# EAGLE design FullTouchSmartphone (EAGLE 8.0.2)
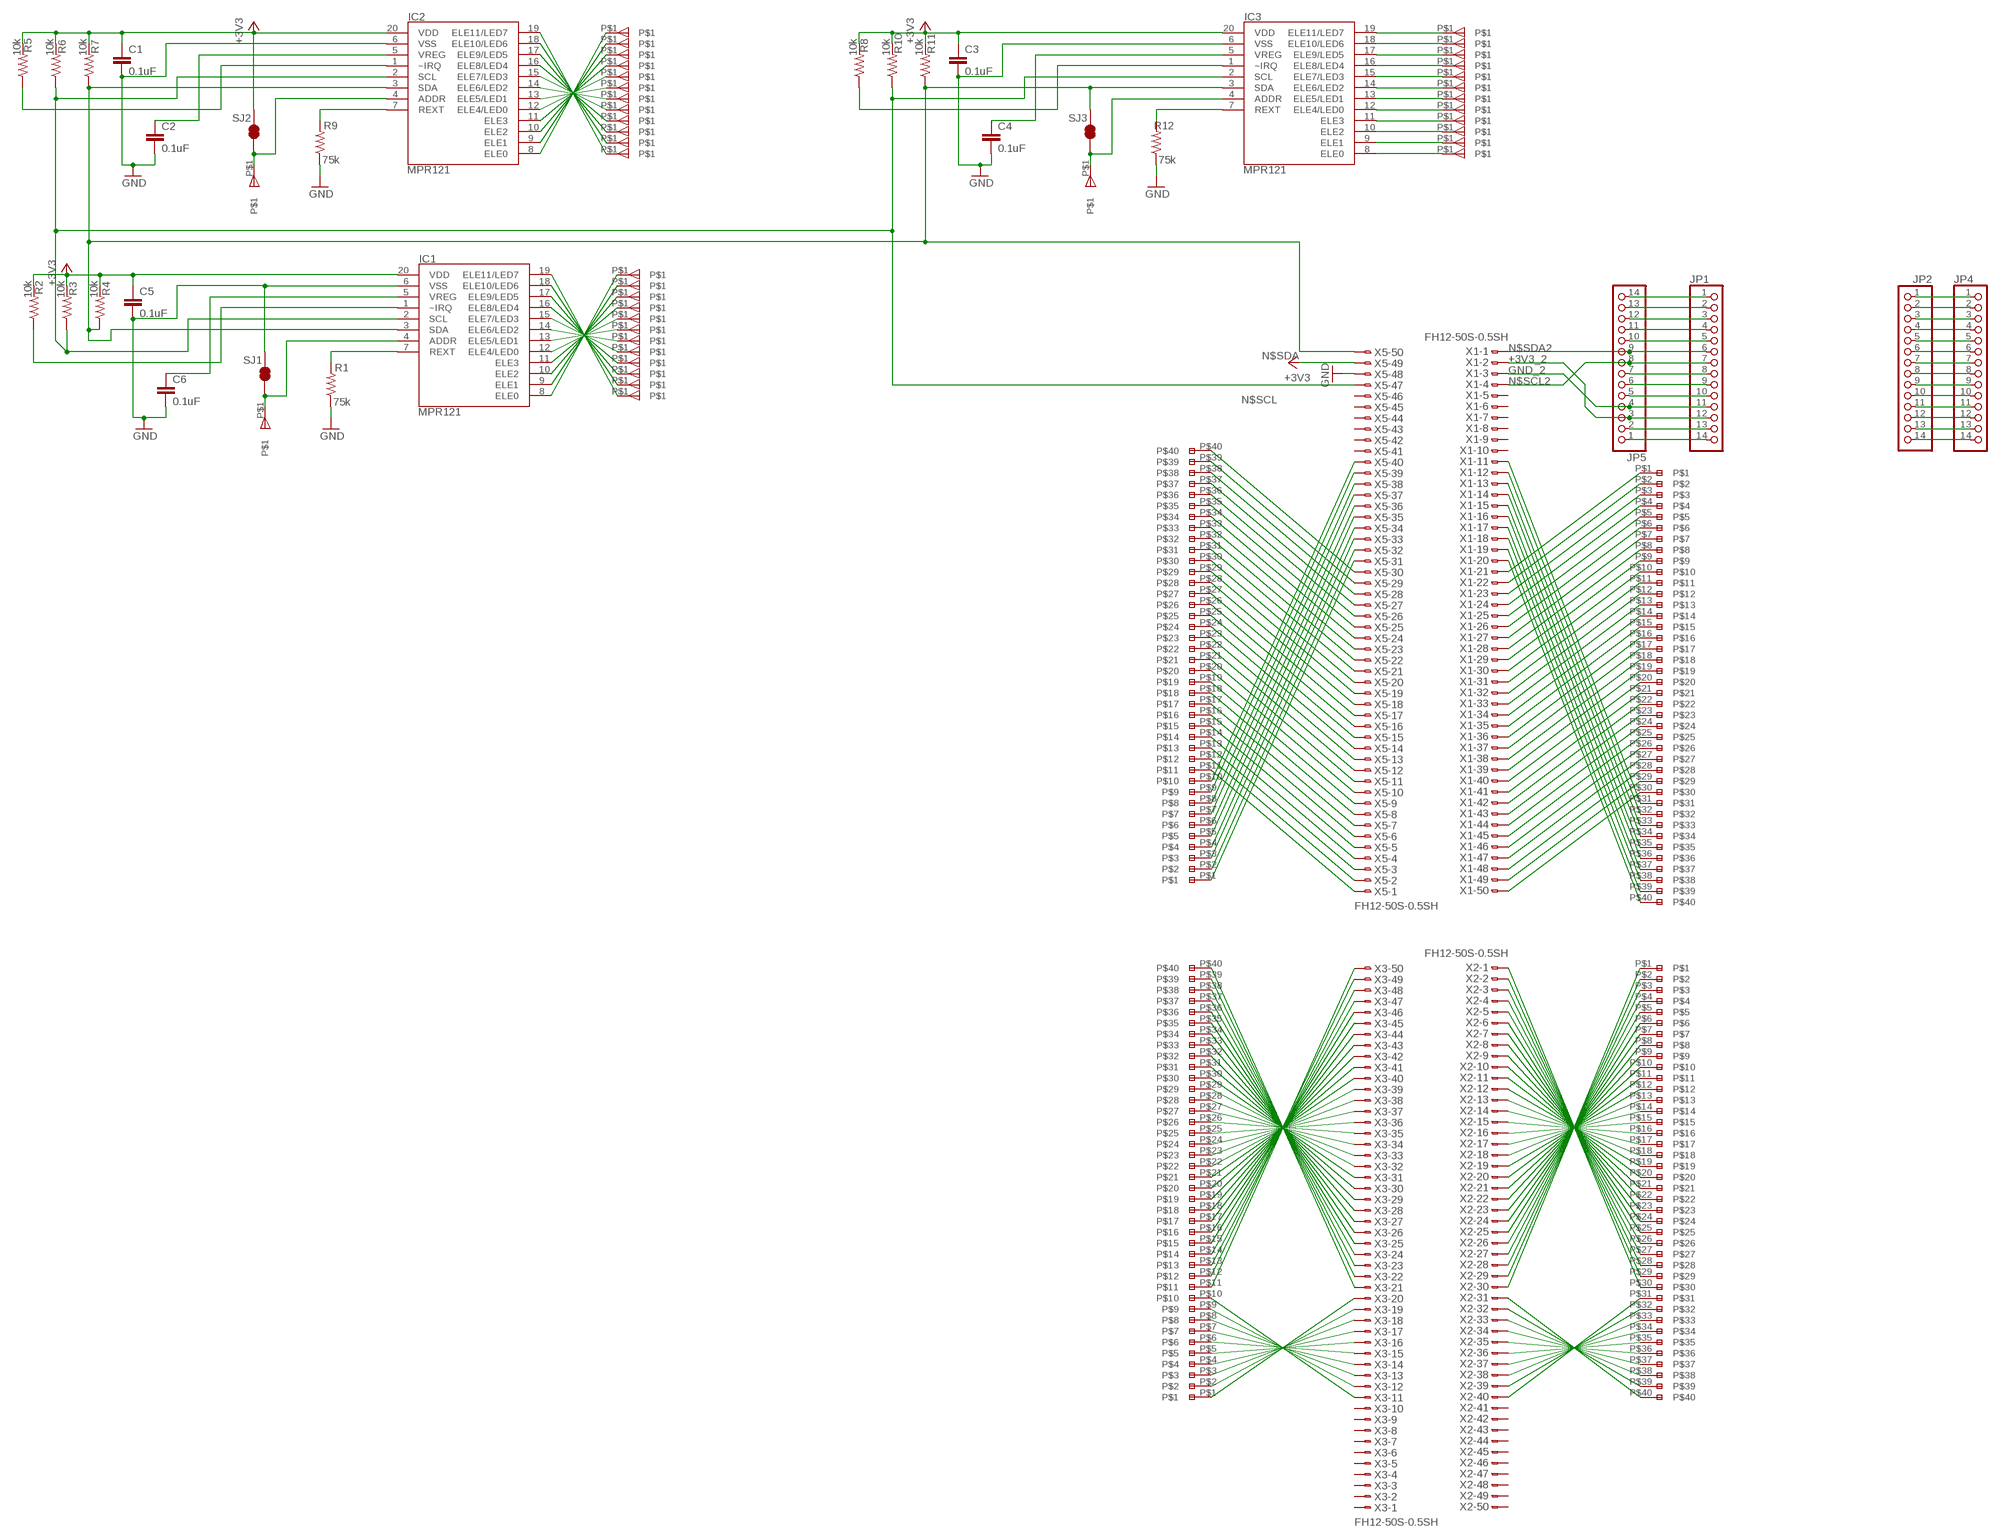
[diagram p0: schematic, sheet 1]

## Parts
C1  0.1uF  CAP0603-CAP  [0603-CAP]
C2  0.1uF  CAP0603-CAP  [0603-CAP]
C3  0.1uF  CAP0603-CAP  [0603-CAP]
C4  0.1uF  CAP0603-CAP  [0603-CAP]
C5  0.1uF  CAP0603-CAP  [0603-CAP]
C6  0.1uF  CAP0603-CAP  [0603-CAP]
IC1  MPR121  MPR121V2  [QFN-20-0.4MM-V2]
IC2  MPR121  MPR121V2  [QFN-20-0.4MM-V2]
IC3  MPR121  MPR121V2  [QFN-20-0.4MM-V2]
JP1  PINHD-1X14  [1X14]
JP2  PINHD-1X14  [1X14]
JP4  PINHD-1X14  [1X14]
JP5  PINHD-1X14  [1X14]
R1  75k  RESISTOR0603-RES  [0603-RES]
R2  10k  RESISTOR0603-RES  [0603-RES]
R3  10k  RESISTOR0603-RES  [0603-RES]
R4  10k  RESISTOR0603-RES  [0603-RES]
R5  10k  RESISTOR0603-RES  [0603-RES]
R6  10k  RESISTOR0603-RES  [0603-RES]
R7  10k  RESISTOR0603-RES  [0603-RES]
R8  10k  RESISTOR0603-RES  [0603-RES]
R9  75k  RESISTOR0603-RES  [0603-RES]
R10  10k  RESISTOR0603-RES  [0603-RES]
R11  10k  RESISTOR0603-RES  [0603-RES]
R12  75k  RESISTOR0603-RES  [0603-RES]
SJ1  SOLDERJUMPERTRACE  [SJ_2S-TRACE]
SJ2  SOLDERJUMPERTRACE  [SJ_2S-TRACE]
SJ3  SOLDERJUMPERTRACE  [SJ_2S-TRACE]
U$1  AXE640124  [AXE640124]
U$2  AXE640124  [AXE640124]
U$3  AXE540127  [AXE540127]
U$4  SINGLE_LÖT_SPOT_K  [SINGLE_LÖT_SPOT_K]
U$5  SINGLE_LÖT_SPOT_K  [SINGLE_LÖT_SPOT_K]
U$6  SINGLE_LÖT_SPOT_K  [SINGLE_LÖT_SPOT_K]
U$7  SINGLE_LÖT_SPOT_K  [SINGLE_LÖT_SPOT_K]
U$8  SINGLE_LÖT_SPOT_K  [SINGLE_LÖT_SPOT_K]
U$9  SINGLE_LÖT_SPOT_K  [SINGLE_LÖT_SPOT_K]
U$10  SINGLE_LÖT_SPOT_K  [SINGLE_LÖT_SPOT_K]
U$11  SINGLE_LÖT_SPOT_K  [SINGLE_LÖT_SPOT_K]
U$12  SINGLE_LÖT_SPOT_K  [SINGLE_LÖT_SPOT_K]
U$13  SINGLE_LÖT_SPOT_K  [SINGLE_LÖT_SPOT_K]
U$14  SINGLE_LÖT_SPOT_K  [SINGLE_LÖT_SPOT_K]
U$15  SINGLE_LÖT_SPOT_K  [SINGLE_LÖT_SPOT_K]
U$25  SINGLE_LÖT_SPOT_K  [SINGLE_LÖT_SPOT_K]
U$26  SINGLE_LÖT_SPOT_K  [SINGLE_LÖT_SPOT_K]
U$27  SINGLE_LÖT_SPOT_K  [SINGLE_LÖT_SPOT_K]
U$28  SINGLE_LÖT_SPOT_K  [SINGLE_LÖT_SPOT_K]
U$29  SINGLE_LÖT_SPOT_K  [SINGLE_LÖT_SPOT_K]
U$30  SINGLE_LÖT_SPOT_K  [SINGLE_LÖT_SPOT_K]
U$31  SINGLE_LÖT_SPOT_K  [SINGLE_LÖT_SPOT_K]
U$32  SINGLE_LÖT_SPOT_K  [SINGLE_LÖT_SPOT_K]
U$33  SINGLE_LÖT_SPOT_K  [SINGLE_LÖT_SPOT_K]
U$34  SINGLE_LÖT_SPOT_K  [SINGLE_LÖT_SPOT_K]
U$35  SINGLE_LÖT_SPOT_K  [SINGLE_LÖT_SPOT_K]
U$36  SINGLE_LÖT_SPOT_K  [SINGLE_LÖT_SPOT_K]
U$37  SINGLE_LÖT_SPOT_K  [SINGLE_LÖT_SPOT_K]
U$38  SINGLE_LÖT_SPOT_K  [SINGLE_LÖT_SPOT_K]
U$39  SINGLE_LÖT_SPOT_K  [SINGLE_LÖT_SPOT_K]
U$40  SINGLE_LÖT_SPOT_K  [SINGLE_LÖT_SPOT_K]
U$40PIN-BACK  AXE540127  [AXE540127]
U$41  SINGLE_LÖT_SPOT_K  [SINGLE_LÖT_SPOT_K]
U$42  SINGLE_LÖT_SPOT_K  [SINGLE_LÖT_SPOT_K]
U$43  SINGLE_LÖT_SPOT_K  [SINGLE_LÖT_SPOT_K]
U$44  SINGLE_LÖT_SPOT_K  [SINGLE_LÖT_SPOT_K]
U$45  SINGLE_LÖT_SPOT_K  [SINGLE_LÖT_SPOT_K]
U$46  SINGLE_LÖT_SPOT_K  [SINGLE_LÖT_SPOT_K]
U$47  SINGLE_LÖT_SPOT_K  [SINGLE_LÖT_SPOT_K]
U$48  SINGLE_LÖT_SPOT_K  [SINGLE_LÖT_SPOT_K]
U$49  SINGLE_LÖT_SPOT_K  [SINGLE_LÖT_SPOT_K]
U$50  SINGLE_LÖT_SPOT_K  [SINGLE_LÖT_SPOT_K]
U$51  SINGLE_LÖT_SPOT_K  [SINGLE_LÖT_SPOT_K]
X1  FH12-50S-0.5SH  [FH12-50S-0.5SH]
X2  FH12-50S-0.5SH  [FH12-50S-0.5SH]
X3  FH12-50S-0.5SH  [FH12-50S-0.5SH]
X5  FH12-50S-0.5SH  [FH12-50S-0.5SH]

## Nets
+3V3: C1.1 C3.1 C5.1 IC1.20(VDD) IC2.20(VDD) IC3.20(VDD) R2.2 R3.2 R4.2 R5.2 R6.2 R7.2 R8.2 R10.2 R11.2 SJ2.2 X5.49
+3V3_2: JP1.12 JP5.3 X1.2
GND: C1.2 C2.2 C3.2 C4.2 C5.2 C6.2 IC1.6(VSS) IC2.6(VSS) IC3.6(VSS) R1.1 R9.1 R12.1 SJ1.2 X5.48
GND_2: JP1.11 JP5.4 X1.3
N$1: U$40PIN-BACK.P$10 X5.40
N$2: U$40PIN-BACK.P$9 X5.39
N$3: U$40PIN-BACK.P$8 X5.38
N$4: U$40PIN-BACK.P$7 X5.37
N$5: U$40PIN-BACK.P$6 X5.36
N$6: U$40PIN-BACK.P$5 X5.35
N$7: U$40PIN-BACK.P$4 X5.34
N$8: U$40PIN-BACK.P$3 X5.33
N$9: U$40PIN-BACK.P$2 X5.32
N$10: U$40PIN-BACK.P$1 X5.31
N$11: U$40PIN-BACK.P$20 X5.10
N$12: U$40PIN-BACK.P$19 X5.9
N$13: U$40PIN-BACK.P$18 X5.8
N$14: U$40PIN-BACK.P$17 X5.7
N$15: U$40PIN-BACK.P$16 X5.6
N$16: U$40PIN-BACK.P$15 X5.5
N$17: U$40PIN-BACK.P$14 X5.4
N$18: U$40PIN-BACK.P$13 X5.3
N$19: U$40PIN-BACK.P$12 X5.2
N$20: U$40PIN-BACK.P$11 X5.1
N$21: U$40PIN-BACK.P$40 X5.30
N$22: U$40PIN-BACK.P$39 X5.29
N$23: U$40PIN-BACK.P$38 X5.28
N$24: U$40PIN-BACK.P$37 X5.27
N$25: U$40PIN-BACK.P$36 X5.26
N$26: U$40PIN-BACK.P$35 X5.25
N$27: U$40PIN-BACK.P$33 X5.23
N$28: U$40PIN-BACK.P$34 X5.24
N$29: U$40PIN-BACK.P$32 X5.22
N$30: U$40PIN-BACK.P$31 X5.21
N$31: U$40PIN-BACK.P$30 X5.20
N$32: U$40PIN-BACK.P$29 X5.19
N$33: U$40PIN-BACK.P$28 X5.18
N$34: U$40PIN-BACK.P$27 X5.17
N$35: U$40PIN-BACK.P$26 X5.16
N$36: U$40PIN-BACK.P$25 X5.15
N$37: U$40PIN-BACK.P$24 X5.14
N$38: U$40PIN-BACK.P$23 X5.13
N$39: U$40PIN-BACK.P$22 X5.12
N$40: U$40PIN-BACK.P$21 X5.11
N$41: U$2.P$31 X1.11
N$42: U$2.P$30 X1.50
N$43: U$2.P$29 X1.49
N$44: U$2.P$28 X1.48
N$45: U$2.P$27 X1.47
N$46: U$2.P$26 X1.46
N$47: U$2.P$25 X1.45
N$48: U$2.P$24 X1.44
N$49: U$2.P$23 X1.43
N$50: U$2.P$21 X1.41
N$51: U$2.P$22 X1.42
N$52: U$2.P$20 X1.40
N$53: U$2.P$19 X1.39
N$54: U$2.P$18 X1.38
N$55: U$2.P$17 X1.37
N$56: U$2.P$15 X1.35
N$57: U$2.P$16 X1.36
N$58: U$2.P$14 X1.34
N$59: U$2.P$13 X1.33
N$60: U$2.P$12 X1.32
N$61: U$2.P$11 X1.31
N$62: U$2.P$10 X1.30
N$63: U$2.P$9 X1.29
N$64: U$2.P$8 X1.28
N$65: U$2.P$7 X1.27
N$66: U$2.P$6 X1.26
N$67: U$2.P$5 X1.25
N$68: U$2.P$4 X1.24
N$69: U$2.P$3 X1.23
N$70: U$2.P$2 X1.22
N$71: U$2.P$1 X1.21
N$72: U$2.P$32 X1.12
N$73: U$2.P$33 X1.13
N$74: U$2.P$34 X1.14
N$75: U$2.P$35 X1.15
N$76: U$2.P$36 X1.16
N$77: U$2.P$37 X1.17
N$78: U$2.P$38 X1.18
N$79: U$2.P$39 X1.19
N$80: U$2.P$40 X1.20
N$81: U$3.P$20 X3.41
N$82: U$3.P$11 X3.50
N$83: U$3.P$21 X3.40
N$84: U$3.P$22 X3.39
N$85: U$3.P$23 X3.38
N$86: U$3.P$24 X3.37
N$87: U$3.P$25 X3.36
N$88: U$3.P$26 X3.35
N$89: U$3.P$27 X3.34
N$90: U$3.P$28 X3.33
N$91: U$3.P$29 X3.32
N$92: U$3.P$30 X3.31
N$93: U$3.P$31 X3.30
N$94: U$3.P$32 X3.29
N$95: U$3.P$33 X3.28
N$96: U$3.P$34 X3.27
N$97: U$3.P$35 X3.26
N$98: U$3.P$36 X3.25
N$99: U$3.P$37 X3.24
N$100: U$3.P$38 X3.23
N$101: U$3.P$39 X3.22
N$102: U$3.P$40 X3.21
N$103: U$3.P$19 X3.42
N$104: U$3.P$18 X3.43
N$105: U$3.P$17 X3.44
N$106: U$3.P$16 X3.45
N$107: U$3.P$15 X3.46
N$108: U$3.P$14 X3.47
N$109: U$3.P$13 X3.48
N$110: U$3.P$12 X3.49
N$111: U$3.P$1 X3.20
N$112: U$3.P$2 X3.19
N$113: U$3.P$3 X3.18
N$114: U$3.P$4 X3.17
N$115: U$3.P$5 X3.16
N$116: U$3.P$6 X3.15
N$117: U$3.P$7 X3.14
N$118: U$3.P$8 X3.13
N$119: U$3.P$9 X3.12
N$120: U$3.P$10 X3.11
N$121: U$1.P$31 X2.40
N$122: U$1.P$32 X2.39
N$123: U$1.P$33 X2.38
N$124: U$1.P$34 X2.37
N$125: U$1.P$35 X2.36
N$126: U$1.P$36 X2.35
N$127: U$1.P$37 X2.34
N$128: U$1.P$38 X2.33
N$129: U$1.P$39 X2.32
N$130: U$1.P$40 X2.31
N$131: U$1.P$30 X2.1
N$132: U$1.P$29 X2.2
N$133: U$1.P$28 X2.3
N$134: U$1.P$27 X2.4
N$135: U$1.P$26 X2.5
N$136: U$1.P$25 X2.6
N$137: U$1.P$24 X2.7
N$138: U$1.P$23 X2.8
N$139: U$1.P$22 X2.9
N$140: U$1.P$21 X2.10
N$141: U$1.P$20 X2.11
N$142: U$1.P$19 X2.12
N$143: U$1.P$18 X2.13
N$144: U$1.P$17 X2.14
N$145: U$1.P$16 X2.15
N$146: U$1.P$15 X2.16
N$147: U$1.P$14 X2.17
N$148: U$1.P$13 X2.18
N$149: U$1.P$12 X2.19
N$150: U$1.P$11 X2.20
N$151: U$1.P$10 X2.21
N$152: U$1.P$9 X2.22
N$153: U$1.P$8 X2.23
N$154: U$1.P$7 X2.24
N$155: U$1.P$6 X2.25
N$156: U$1.P$5 X2.26
N$157: U$1.P$4 X2.27
N$158: U$1.P$3 X2.28
N$159: U$1.P$2 X2.29
N$160: U$1.P$1 X2.30
N$165: IC1.19(ELE11/LED7) U$15.P$1
N$166: IC1.18(ELE10/LED6) U$14.P$1
N$167: IC1.17(ELE9/LED5) U$13.P$1
N$168: IC1.16(ELE8/LED4) U$12.P$1
N$169: IC1.15(ELE7/LED3) U$11.P$1
N$170: IC1.14(ELE6/LED2) U$10.P$1
N$171: IC1.13(ELE5/LED1) U$9.P$1
N$172: IC1.12(ELE4/LED0) U$8.P$1
N$173: IC1.11(ELE3) U$7.P$1
N$174: IC1.10(ELE2) U$6.P$1
N$175: IC1.9(ELE1) U$5.P$1
N$176: IC1.8(ELE0) U$4.P$1
N$177: IC3.19(ELE11/LED7) U$40.P$1
N$178: IC3.18(ELE10/LED6) U$41.P$1
N$179: IC3.17(ELE9/LED5) U$42.P$1
N$180: IC3.16(ELE8/LED4) U$43.P$1
N$181: IC3.15(ELE7/LED3) U$44.P$1
N$182: IC3.14(ELE6/LED2) U$45.P$1
N$183: IC3.13(ELE5/LED1) U$46.P$1
N$184: IC3.12(ELE4/LED0) U$47.P$1
N$185: IC3.10(ELE2) U$49.P$1
N$186: IC3.11(ELE3) U$48.P$1
N$187: IC3.9(ELE1) U$50.P$1
N$188: IC3.8(ELE0) U$51.P$1
N$189: JP2.1 JP4.1
N$190: JP2.2 JP4.2
N$192: C6.1 IC1.5(VREG)
N$193: C2.1 IC2.5(VREG)
N$194: IC1.7(REXT) R1.2
N$195: IC2.8(ELE0) U$36.P$1
N$196: IC2.9(ELE1) U$35.P$1
N$197: C4.1 IC3.5(VREG)
N$198: IC2.10(ELE2) U$34.P$1
N$199: IC2.11(ELE3) U$33.P$1
N$200: IC2.12(ELE4/LED0) U$32.P$1
N$201: IC2.13(ELE5/LED1) U$31.P$1
N$202: IC2.14(ELE6/LED2) U$30.P$1
N$203: IC2.15(ELE7/LED3) U$29.P$1
N$204: IC2.16(ELE8/LED4) U$28.P$1
N$205: IC2.17(ELE9/LED5) U$27.P$1
N$206: IC2.18(ELE10/LED6) U$26.P$1
N$207: IC2.19(ELE11/LED7) U$25.P$1
N$228: IC1.4(ADDR) SJ1.1 U$37.P$1
N$230: IC2.7(REXT) R9.2
N$231: IC3.7(REXT) R12.2
N$243: IC2.4(ADDR) SJ2.1 U$38.P$1
N$244: IC3.4(ADDR) SJ3.1 U$39.P$1
N$245: JP2.3 JP4.3
N$246: JP2.4 JP4.4
N$247: JP2.5 JP4.5
N$248: JP2.6 JP4.6
N$249: JP2.7 JP4.7
N$250: JP2.8 JP4.8
N$251: JP2.9 JP4.9
N$252: JP2.10 JP4.10
N$253: JP2.11 JP4.11
N$254: JP2.12 JP4.12
N$255: JP2.13 JP4.13
N$256: JP2.14 JP4.14
N$257: JP1.1 JP5.14
N$258: JP1.2 JP5.13
N$259: JP1.3 JP5.12
N$260: JP1.4 JP5.11
N$261: JP1.5 JP5.10
N$262: JP1.8 JP5.7
N$263: JP1.9 JP5.6
N$264: JP1.10 JP5.5
N$265: JP1.13 JP5.2
N$266: JP1.14 JP5.1
N$IRQ1: IC1.1(~IRQ) R2.1
N$IRQ2: IC2.1(~IRQ) R5.1
N$IRQ3: IC3.1(~IRQ) R8.1
N$SCL: IC1.2(SCL) IC2.2(SCL) IC3.2(SCL) R3.1 R6.1 R10.1 X5.47
N$SCL2: JP1.7 JP5.8 X1.4
N$SDA: IC1.3(SDA) IC2.3(SDA) IC3.3(SDA) R4.1 R7.1 R11.1 SJ3.2 X5.50
N$SDA2: JP1.6 JP5.9 X1.1
Unconnected: X1.5 X1.6 X1.7 X1.8 X1.9 X1.10 X2.41 X2.42 X2.43 X2.44 X2.45 X2.46 X2.47 X2.48 X2.49 X2.50 X3.1 X3.2 X3.3 X3.4 X3.5 X3.6 X3.7 X3.8 X3.9 X3.10 X5.41 X5.42 X5.43 X5.44 X5.45 X5.46

## Library data of the parts
C1-C6 = SparkFun:CAP: Capacitor Standard 0603 ceramic capacitor, and 0.1" leaded capacitor.
IC1-IC3 = Testing:MPR121: MPR121 Capacitive Touch Sensor Controller. Variant "V2" was created using an image import of the bottom of the IC. It matches metal to metal.
JP1 JP2 JP4 JP5 = pinhead:PINHD-1X14: PIN HEADER
R1-R12 = SparkFun:RESISTOR: Resistor Basic schematic elements and footprints for 0603, 1206, and PTH 1/10th watt (small) resistors.
SJ1-SJ3 = SparkFun:SOLDERJUMPER: Solder Jumper Standard SMD solder jumper. Used to automate production. Two varients : Normally Open and Normally Closed are the same, but have different paste layers. NC will have a large amount of paste and should jumper during reflow.
U$1 U$2 = axexxxxxx:AXE640124
U$3 U$40PIN-BACK = axexxxxxx:AXE540127
U$4-U$15 U$25-U$51 = single_löt_spot:SINGLE_LÖT_SPOT_K
X1-X3 X5 = con-hirose:FH12-50S-0.5S: 0.5mm Pitch Connectors For FPC/FFC Source: Data sheet <http://www.hirose.co.jp/cataloge_hp/e58605370.pdf>; MPN: FH12-50S-0.5SH(55); OC_FARNELL: 1324557; OC_NEWARK: 34M6181

## Board
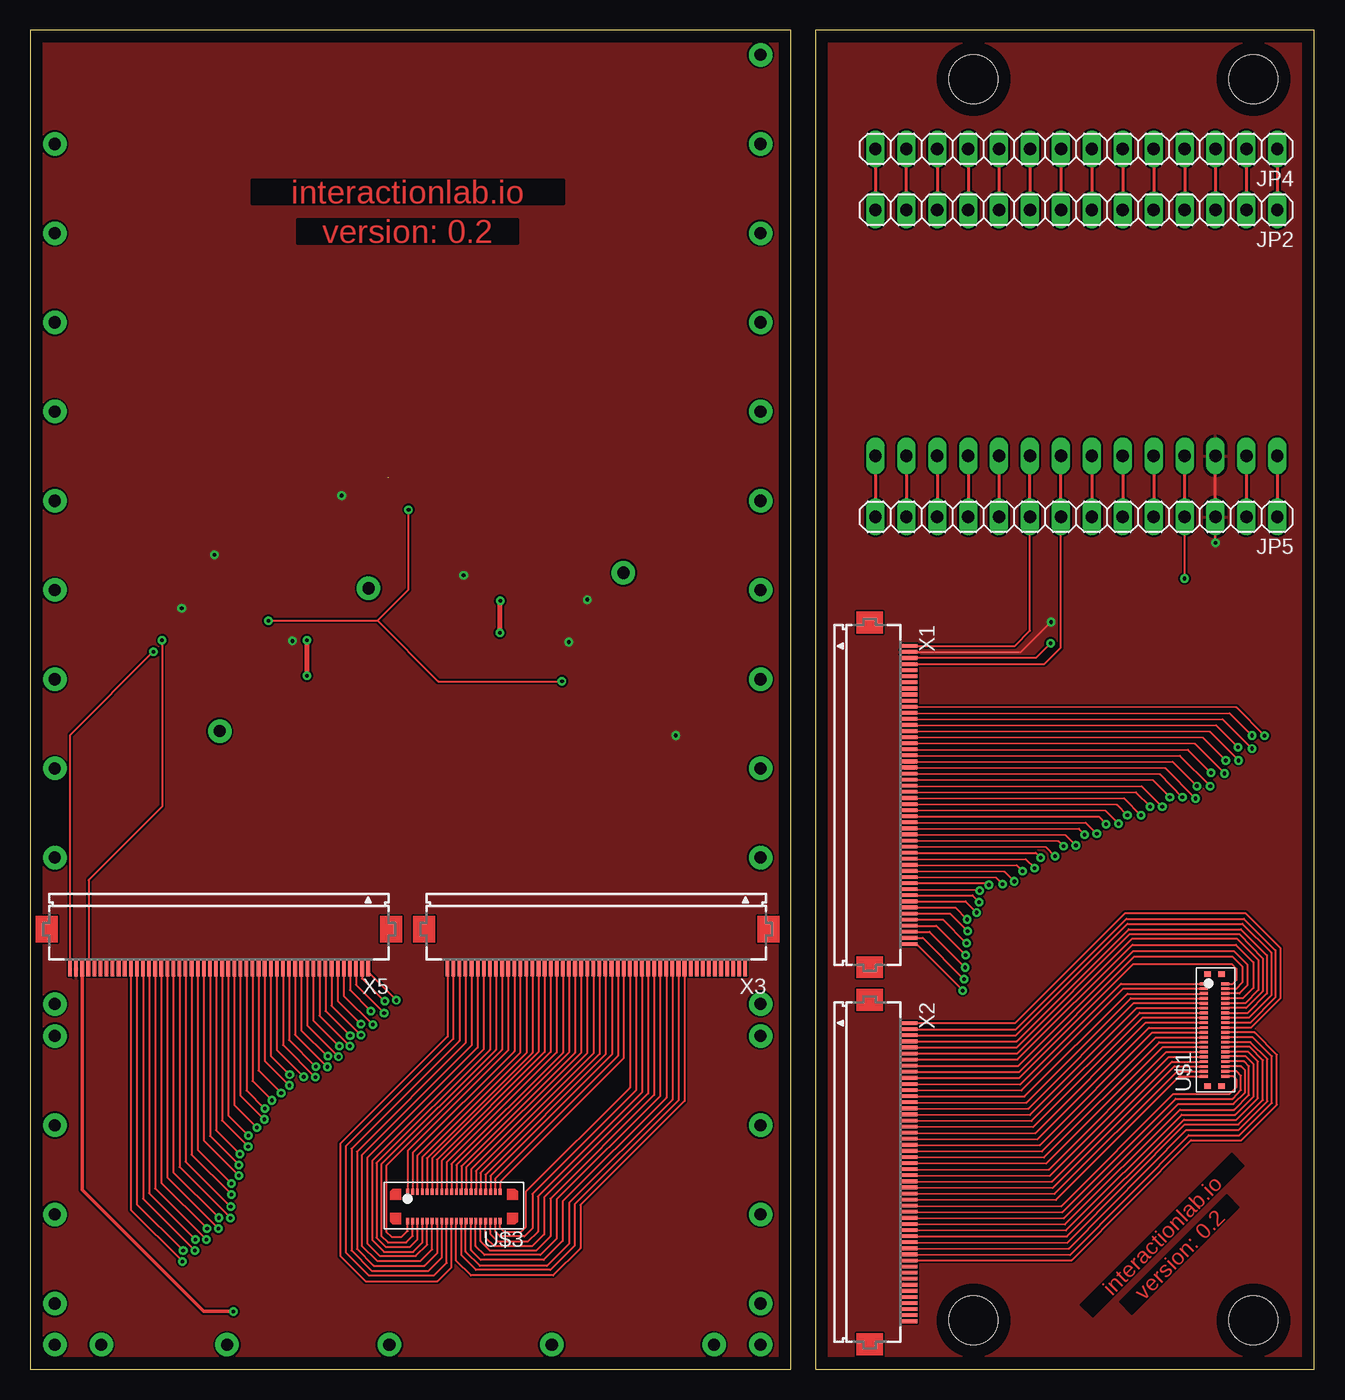
[diagram p1: board, top side]
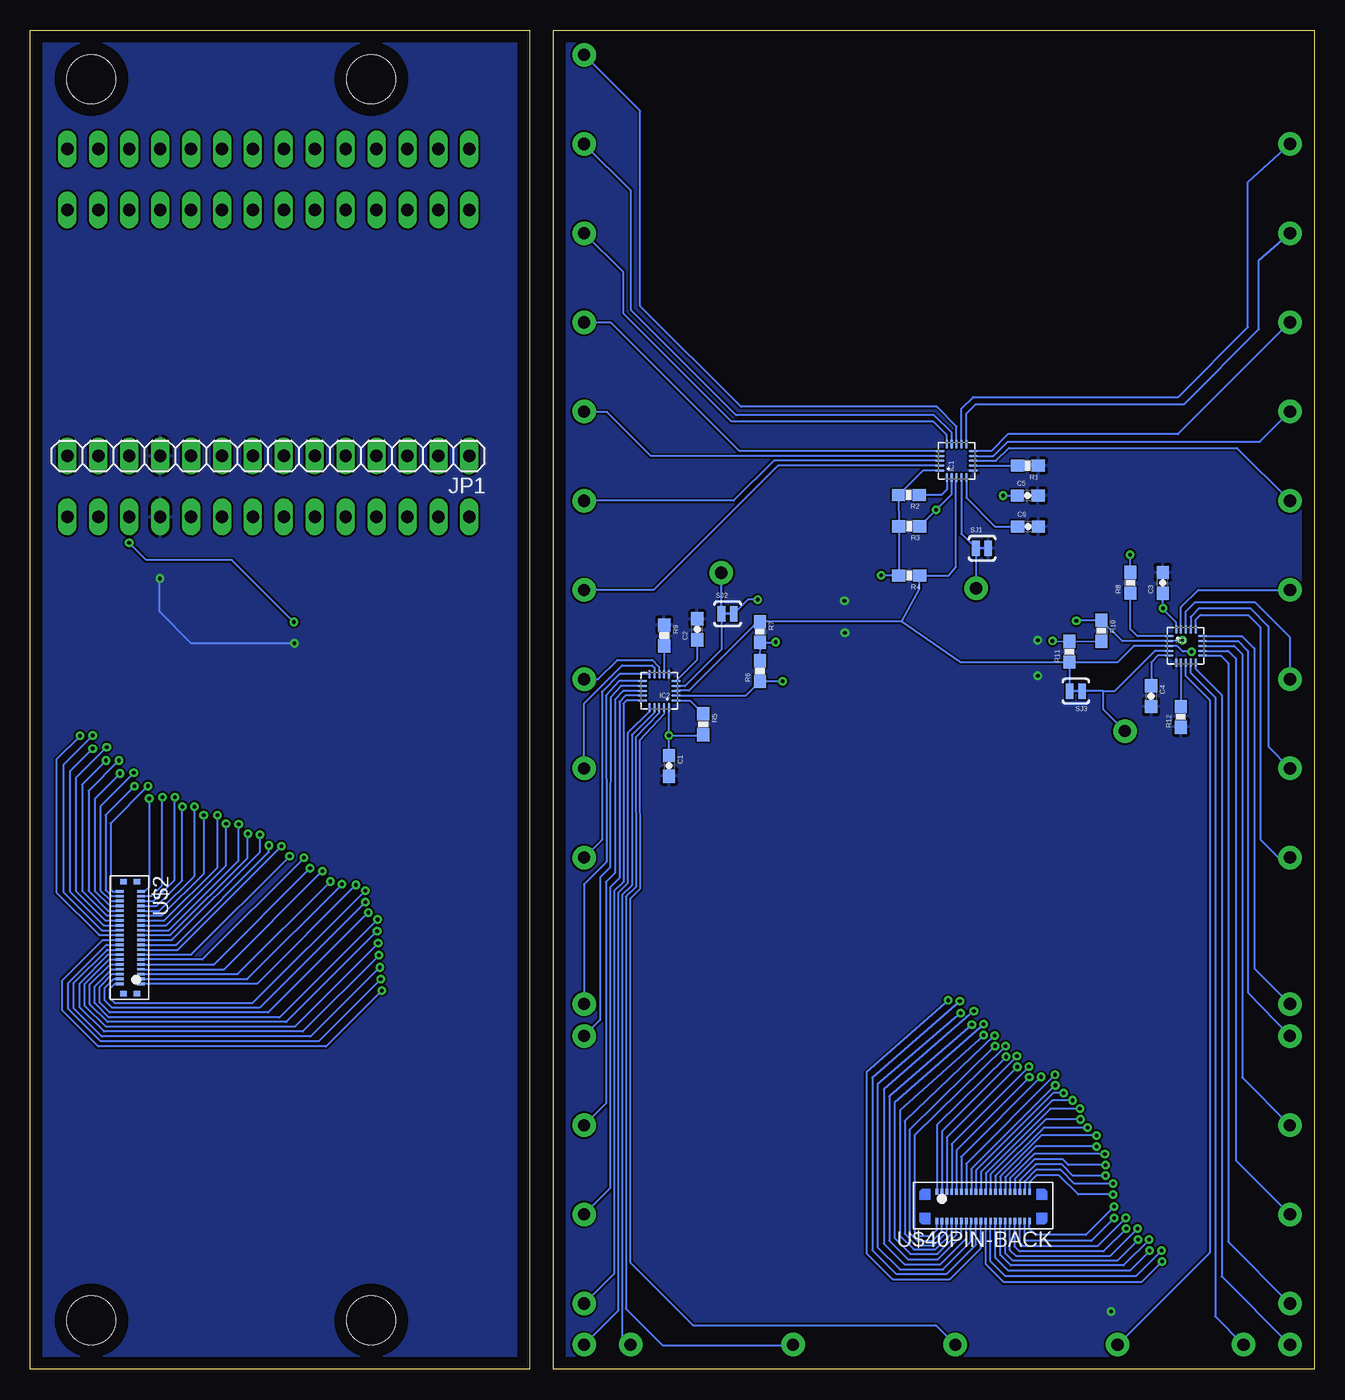
[diagram p2: board, bottom side, seen from below]

Size 105.5 x 110 mm. Coordinates in mm from the lower left corner, seen from the top.
Outline: 0,0 62.5,0 62.5,110 0,110 0,0
Outline: 64.5,0 105.5,0 105.5,110 64.5,110 64.5,0
Copper layers (1*16): Top 0.035mm / dielectric 1.5mm / Bottom 0.035mm
Design rules "default *": minimum track width 6mil, minimum drill 8mil, track to track 6mil, track to pad 6mil, pad to pad 6mil, via to via 6mil, smd to smd 6mil, copper to edge 40mil, drill to drill 8mil, minimum pad ring 10mil, minimum via ring 8mil, stop-mask expansion 4mil, vias tented up to drill 0mil, thermal gap 10mil
Holes 4 mm at 77.5,106 100.5,106 77.5,4 100.5,4

### Footprints (pad centres in the part's own frame; a part is rotated, then mirrored left to right if it is on the bottom)
0603-CAP = smd 1.1 x 1: 1 -0.85,0; 2 0.85,0
QFN-20-0.4MM-V2 = smd 0.75 x 0.195: 1 -1.367,0.8; 2 -1.367,0.4; 3 -1.367,0; 4 -1.367,-0.4; 5 -1.367,-0.8; 11 1.375,-0.8; 12 1.375,-0.4; 13 1.375,0; 14 1.375,0.4; 15 1.375,0.8 | smd 0.195 x 0.75: 6 -0.795,-1.372; 7 -0.395,-1.372; 8 0.005,-1.372; 9 0.405,-1.372; 10 0.805,-1.372; 16 0.81,1.372; 17 0.41,1.372; 18 0.01,1.372; 19 -0.39,1.372; 20 -0.79,1.372
1X14 = drill 1.016 long: 1 -16.51,0; 2 -13.97,0; 3 -11.43,0; 4 -8.89,0; 5 -6.35,0; 6 -3.81,0; 7 -1.27,0; 8 1.27,0; 9 3.81,0; 10 6.35,0; 11 8.89,0; 12 11.43,0; 13 13.97,0; 14 16.51,0
0603-RES = smd 1.1 x 1: 1 -0.85,0; 2 0.85,0
SJ_2S-TRACE = smd 0.635 x 1.27: 1 -0.508,0; 2 0.508,0
AXE640124 = smd 0.23 x 0.65: P$1 0,0; P$2 0.4,0; P$3 0.8,0; P$4 1.2,0; P$5 1.6,0; P$6 2,0; P$7 2.4,0; P$8 2.8,0; P$9 3.2,0; P$10 3.6,0; P$11 4,0; P$12 4.4,0; P$13 4.8,0; P$14 5.2,0; P$15 5.6,0; P$16 6,0; P$17 6.4,0; P$18 6.8,0; P$19 7.2,0; P$20 7.6,0; P$21 7.6,-1.75; P$22 7.2,-1.75; P$23 6.8,-1.75; P$24 6.4,-1.75; P$25 6,-1.75; P$26 5.6,-1.75; P$27 5.2,-1.75; P$28 4.8,-1.75; P$29 4.4,-1.75; P$30 4,-1.75; P$31 3.6,-1.75; P$32 3.2,-1.75; P$33 2.8,-1.75; P$34 2.4,-1.75; P$35 2,-1.75; P$36 1.6,-1.75; P$37 1.2,-1.75; P$38 0.8,-1.75; P$39 0.4,-1.75; P$40 0,-1.75 | smd 0.45 x 0.53: P$42 -0.8,-1.44; P$43 -0.8,-0.31; P$44 8.4,-0.31; P$45 8.4,-1.44
AXE540127 = smd 0.23 x 0.5: P$1 0,0; P$2 0.4,0; P$3 0.8,0; P$4 1.2,0; P$5 1.6,0; P$6 2,0; P$7 2.4,0; P$8 2.8,0; P$9 3.2,0; P$10 3.6,0; P$11 4,0; P$12 4.4,0; P$13 4.8,0; P$14 5.2,0; P$15 5.6,0; P$16 6,0; P$17 6.4,0; P$18 6.8,0; P$19 7.2,0; P$20 7.6,0; P$21 7.6,-2.4; P$22 7.2,-2.4; P$23 6.8,-2.4; P$24 6.4,-2.4; P$25 6,-2.4; P$26 5.6,-2.4; P$27 5.2,-2.4; P$28 4.8,-2.4; P$29 4.4,-2.4; P$30 4,-2.4; P$31 3.6,-2.4; P$32 3.2,-2.4; P$33 2.8,-2.4; P$34 2.4,-2.4; P$35 2,-2.4; P$36 1.6,-2.4; P$37 1.2,-2.4; P$38 0.8,-2.4; P$39 0.4,-2.4; P$40 0,-2.4
SINGLE_LÖT_SPOT_K = drill 1 pad 1.93: P$1 0,0
FH12-50S-0.5SH = smd 0.3 x 1.3: 1 -12.25,3.25; 2 -11.75,3.25; 3 -11.25,3.25; 4 -10.75,3.25; 5 -10.25,3.25; 6 -9.75,3.25; 7 -9.25,3.25; 8 -8.75,3.25; 9 -8.25,3.25; 10 -7.75,3.25; 11 -7.25,3.25; 12 -6.75,3.25; 13 -6.25,3.25; 14 -5.75,3.25; 15 -5.25,3.25; 16 -4.75,3.25; 17 -4.25,3.25; 18 -3.75,3.25; 19 -3.25,3.25; 20 -2.75,3.25; 21 -2.25,3.25; 22 -1.75,3.25; 23 -1.25,3.25; 24 -0.75,3.25; 25 -0.25,3.25; 26 0.25,3.25; 27 0.75,3.25; 28 1.25,3.25; 29 1.75,3.25; 30 2.25,3.25; 31 2.75,3.25; 32 3.25,3.25; 33 3.75,3.25; 34 4.25,3.25; 35 4.75,3.25; 36 5.25,3.25; 37 5.75,3.25; 38 6.25,3.25; 39 6.75,3.25; 40 7.25,3.25; 41 7.75,3.25; 42 8.25,3.25; 43 8.75,3.25; 44 9.25,3.25; 45 9.75,3.25; 46 10.25,3.25; 47 10.75,3.25; 48 11.25,3.25; 49 11.75,3.25; 50 12.25,3.25

### Placement (x,y rotation side)
C1  53.03,49.57 270 bottom
C2  50.71,60.79 90 bottom
C3  12.45,64.6 90 bottom
C4  13.41,55.3 270 bottom
C5  23.55,71.78 0 bottom
C6  23.52,69.24 0 bottom
IC1  29.4,74.63 90 bottom
IC2  53.82,55.73 180 bottom
IC3  10.56,59.42 0 bottom
JP1  85.95,75.03 180 bottom
JP2  85.95,95.26 180 top
JP4  85.95,100.26 180 top
JP5  85.95,70.03 180 top
R1  23.54,74.23 180 bottom
R2  33.32,71.83 180 bottom
R3  33.29,69.25 180 bottom
R4  33.29,65.21 180 bottom
R5  50.21,52.99 270 bottom
R6  45.55,57.36 90 bottom
R7  45.55,60.57 270 bottom
R8  15.12,64.62 90 bottom
R9  53.42,60.28 270 bottom
R10  17.49,60.67 270 bottom
R11  20.12,58.95 90 bottom
R12  10.96,53.6 90 bottom
SJ1  27.3,67.45 0 bottom
SJ2  48.21,62.07 0 bottom
SJ3  19.59,55.71 180 bottom
U$1  96.42,24.06 90 top
U$2  96.42,39.26 270 bottom
U$3  38.6,12.16 180 top
U$4  2,71.35 90 top
U$5  2,78.68 90 top
U$6  2,86.01 90 top
U$7  2,93.34 90 top
U$8  2,100.67 90 top
U$9  60,108 90 top
U$10  60,100.67 90 top
U$11  60,93.34 90 top
U$12  60,86.01 90 top
U$13  60,78.68 90 top
U$14  60,71.35 90 top
U$15  60,64.02 90 top
U$25  29.5,2 270 top
U$26  42.84,2 90 top
U$27  56.18,2 90 top
U$28  60,2 90 top
U$29  60,5.38 180 top
U$30  60,12.71 180 top
U$31  60,20.04 180 top
U$32  60,27.37 180 top
U$33  60,30 180 top
U$34  60,42.03 180 top
U$35  60,49.36 180 top
U$36  60,56.69 180 top
U$37  27.79,64.16 0 top
U$38  48.73,65.43 0 top
U$39  15.56,52.42 90 top
U$40  2,64.02 0 top
U$40PIN-BACK  23.4,12.16 180 bottom
U$41  2,56.69 0 top
U$42  2,49.36 0 top
U$43  2,42.03 0 top
U$44  2,30 0 top
U$45  2.01,27.37 0 top
U$46  2.01,20.04 0 top
U$47  2,12.71 0 top
U$48  2,5.38 0 top
U$49  2,2 0 top
U$50  5.82,2 0 top
U$51  16.16,2 0 top
X1  68.97,47.18 270 top
X2  68.97,16.18 270 top
X3  46.5,36.15 180 top
X5  15.5,36.15 180 top

### Tracks (layer width: path | path; a pad name or v marks a point on that pad's centre or on a via)
+3V3  (via drill 0.3, 0.3 pad 0.61, 0.3 pad 0.71)
  Bottom 0.16: R10.2 R11.2 v21.52,59.83 | R8.2 v15.12,66.9 v15.13,66.9 | IC3.20 11.35,61.36 12.43,62.44 v12.43,62.52 C3.1 | v25.57,71.78 C5.1 | v35.6,65.23 v35.59,65.22 v35.58,65.21 R4.2 R3.2 R2.2 32.16,73.84 IC1.20 | v45.75,63.23 46.54,63.23 SJ2.2 | R6.2 45.52,59.69 R7.2 44.27,59.72 v44.25,59.74 | v53.03,52.06 IC2.20 | 50.25,52.1 R5.2 50.29,52.06 v53.03,52.06 | C1.1 v53.03,52.06
  pour Top: 0,0 62.5,0 62.5,110 0,110
+3V3_2  (via drill 0.3)
  Top 0.16: X1.2 81.4,58.93 v83.86,61.39 | v97.38,67.89 JP5.3
  Top 0.254: JP5.3 JP1.12
  Bottom 0.16: v83.86,61.39 88.95,66.48 95.97,66.48 v97.38,67.89
  pour Top: 64.5,0 105.5,0 105.5,110 64.5,110
GND  (via drill 0.3, 0.3 pad 0.61)
  Top 0.305: v16.69,4.73 v16.68,4.74 14.22,4.74 4.25,14.71 X5.48
  Top 0.406: v22.72,56.96 v22.72,59.88 | v38.57,60.51 38.61,60.55 v38.61,63.14
  Bottom 0.16: IC1.6 arc-90 IC1.6
  pour Bottom: 0,110 62.5,110 62.5,0 0,0
GND_2  (via drill 0.3 pad 0.61)
  Top 0.16: X1.3 82.62,58.43 v83.82,59.63 | JP5.4 v94.85,64.96
  Top 0.254: JP5.4 JP1.11
  Bottom 0.16: v94.85,64.96 94.88,64.93 94.88,62.23 92.28,59.63 v83.82,59.63
  pour Bottom: 64.5,110 105.5,110 105.5,0 64.5,0
N$1  (via drill 0.3 pad 0.61)
  Top 0.16: X5.40 8.25,13.1 v12.5,8.85
  Bottom 0.16: v12.5,8.85 14.21,7.14 25.52,7.14 27,8.62 U$40PIN-BACK.P$10
N$2  (via drill 0.3 pad 0.61)
  Top 0.16: X5.39 8.75,13.54 v12.55,9.74
  Bottom 0.16: v12.55,9.74 14.66,7.63 25.38,7.63 26.6,8.85 U$40PIN-BACK.P$9
N$3  (via drill 0.3 pad 0.61)
  Top 0.16: X5.38 9.25,14.01 v13.53,9.73
  Bottom 0.16: v13.53,9.73 15.17,8.09 25.13,8.09 26.2,9.16 U$40PIN-BACK.P$8
N$4  (via drill 0.3 pad 0.61)
  Top 0.16: X5.37 9.75,14.46 v13.57,10.64
  Bottom 0.16: v13.57,10.64 15.69,8.52 24.94,8.52 25.8,9.38 U$40PIN-BACK.P$7
N$5  (via drill 0.3 pad 0.61)
  Top 0.16: X5.36 10.25,14.85 v14.47,10.63
  Bottom 0.16: v14.47,10.63 16.19,8.91 24.78,8.91 25.4,9.53 U$40PIN-BACK.P$6
N$6  (via drill 0.3 pad 0.61)
  Top 0.16: X5.35 10.75,15.32 v14.52,11.55
  Bottom 0.16: v14.52,11.55 16.79,9.28 24.5,9.28 25,9.78 U$40PIN-BACK.P$5
N$7  (via drill 0.3 pad 0.61)
  Top 0.16: X5.34 11.25,15.74 v15.45,11.54
  Bottom 0.16: v15.45,11.54 17.33,9.66 24.23,9.66 24.6,10.03 U$40PIN-BACK.P$4
N$8  (via drill 0.3 pad 0.61)
  Top 0.16: X5.33 11.75,16.17 v15.49,12.43
  Bottom 0.16: v15.49,12.43 17.83,10.09 23.92,10.09 24.2,10.37 U$40PIN-BACK.P$3
N$9  (via drill 0.3 pad 0.61)
  Top 0.16: X5.32 12.25,16.61 v16.44,12.42
  Bottom 0.16: v16.44,12.42 18.32,10.54 23.65,10.54 23.8,10.69 U$40PIN-BACK.P$2
N$10  (via drill 0.3 pad 0.61)
  Top 0.16: X5.31 12.75,17.05 v16.46,13.34
  Bottom 0.16: v16.46,13.34 18.77,11.03 22.9,11.03 23.4,11.53 U$40PIN-BACK.P$1
N$11  (via drill 0.3 pad 0.61)
  Top 0.16: X5.10 23.25,28.66 v25.38,26.53
  Bottom 0.16: v25.38,26.53 32.85,19.2 32.85,11.3 32.49,10.94 31.51,10.94 31,11.45 U$40PIN-BACK.P$20
N$12  (via drill 0.3 pad 0.61)
  Top 0.16: X5.9 23.75,29.04 v26.24,26.55
  Bottom 0.16: v26.24,26.55 33.26,19.66 33.26,11.19 32.63,10.56 31.38,10.56 30.6,11.34 U$40PIN-BACK.P$19
N$13  (via drill 0.3 pad 0.61)
  Top 0.16: X5.8 24.25,29.43 v26.27,27.41
  Bottom 0.16: v26.27,27.41 33.65,20.38 33.65,11.11 32.73,10.19 31.27,10.19 30.2,11.26 U$40PIN-BACK.P$18
N$14  (via drill 0.3 pad 0.61)
  Top 0.16: X5.7 24.75,29.85 v27.17,27.43
  Bottom 0.16: v27.17,27.43 34.05,21.25 34.05,10.96 32.92,9.83 31.14,9.83 29.8,11.17 U$40PIN-BACK.P$17
N$15  (via drill 0.3 pad 0.61)
  Top 0.16: X5.6 25.25,30.26 v27.17,28.34
  Bottom 0.16: v27.17,28.34 34.49,21.86 34.49,10.77 33.19,9.47 30.97,9.47 29.4,11.04 U$40PIN-BACK.P$16
N$16  (via drill 0.3 pad 0.61)
  Top 0.16: X5.5 25.75,30.68 v28.14,28.29
  Bottom 0.16: v28.14,28.29 34.93,22.4 34.93,10.55 33.41,9.03 30.93,9.03 29,10.96 U$40PIN-BACK.P$15
N$17  (via drill 0.3 pad 0.61)
  Top 0.16: X5.4 26.25,31.14 v27.97,29.42
  Bottom 0.16: v27.97,29.42 35.38,22.98 35.38,10.31 33.7,8.63 30.72,8.63 28.6,10.75 U$40PIN-BACK.P$14
N$18  (via drill 0.3 pad 0.61)
  Top 0.16: X5.3 26.75,31.57 v29.06,29.26
  Bottom 0.16: v29.06,29.26 35.88,23.38 35.88,10 34.06,8.18 30.51,8.18 28.2,10.49 U$40PIN-BACK.P$13
N$19  (via drill 0.3 pad 0.61)
  Top 0.16: X5.2 27.25,32.1 v29.12,30.23
  Bottom 0.16: v29.12,30.23 36.31,23.94 36.31,9.76 34.37,7.82 30.21,7.82 27.8,10.23 U$40PIN-BACK.P$12
N$20  (via drill 0.3 pad 0.61)
  Top 0.16: 27.75,32.33 X5.1 27.75,32.63 v30.08,30.3
  Bottom 0.16: v30.08,30.3 36.79,24.39 36.79,9.51 34.66,7.38 29.96,7.38 27.4,9.94 U$40PIN-BACK.P$11
N$21  (via drill 0.3 pad 0.61)
  Top 0.16: X5.30 13.25,17.62 v16.53,14.34
  Bottom 0.16: v16.53,14.34 19.4,14.34 20.97,15.91 22.83,15.91 23.4,15.34 U$40PIN-BACK.P$40
N$22  (via drill 0.3 pad 0.61)
  Top 0.16: X5.29 13.75,18 v16.52,15.23
  Bottom 0.16: v16.52,15.23 19.71,15.23 20.84,16.36 22.88,16.36 23.8,15.44 U$40PIN-BACK.P$39
N$23  (via drill 0.3 pad 0.61)
  Top 0.16: X5.28 14.25,18.79 v17.14,15.9
  Bottom 0.16: v17.14,15.9 19.83,15.9 20.76,16.83 22.89,16.83 24.2,15.52 U$40PIN-BACK.P$38
N$24  (via drill 0.3 pad 0.61)
  Top 0.16: X5.27 14.75,19.16 v17.14,16.77
  Bottom 0.16: v17.14,16.77 20.21,16.77 20.66,17.22 23.01,17.22 24.6,15.63 U$40PIN-BACK.P$37
N$25  (via drill 0.3 pad 0.61)
  Top 0.16: X5.26 15.25,19.63 v17.21,17.67
  Bottom 0.16: v17.21,17.67 23.01,17.67 25,15.68 U$40PIN-BACK.P$36
N$26  (via drill 0.3 pad 0.61)
  Top 0.16: X5.25 15.75,20.43 v17.89,18.29
  Bottom 0.16: v17.89,18.29 22.87,18.29 25.4,15.76 U$40PIN-BACK.P$35
N$27  (via drill 0.3 pad 0.61)
  Top 0.16: X5.23 16.75,21.71 v18.62,19.84
  Bottom 0.16: v18.62,19.84 22.24,19.84 26.21,15.87 U$40PIN-BACK.P$33
N$28  (via drill 0.3 pad 0.61)
  Top 0.16: X5.24 16.25,20.84 v17.9,19.19
  Bottom 0.16: v17.9,19.19 22.44,19.19 25.8,15.83 U$40PIN-BACK.P$34
N$29  (via drill 0.3 pad 0.61)
  Top 0.16: X5.22 17.25,22.49 v19.22,20.52
  Bottom 0.16: v19.22,20.52 22.07,20.52 26.6,15.99 U$40PIN-BACK.P$32
N$30  (via drill 0.3 pad 0.61)
  Top 0.16: X5.21 17.75,22.9 v19.26,21.39
  Bottom 0.16: v19.26,21.39 21.7,21.39 26.99,16.1 U$40PIN-BACK.P$31
N$31  (via drill 0.3 pad 0.61)
  Top 0.16: X5.20 18.25,23.68 v19.85,22.08
  Bottom 0.16: v19.85,22.08 21.51,22.08 27.39,16.2 U$40PIN-BACK.P$30
N$32  (via drill 0.3 pad 0.61)
  Top 0.16: X5.19 18.75,24.53 v20.6,22.68
  Bottom 0.16: v20.6,22.68 21.45,22.68 27.8,16.33 U$40PIN-BACK.P$29
N$33  (via drill 0.3 pad 0.61)
  Top 0.16: X5.18 19.25,25.34 v21.28,23.31
  Bottom 0.16: v21.28,23.31 21.33,23.31 28.19,16.45 U$40PIN-BACK.P$28
N$34  (via drill 0.3 pad 0.61)
  Top 0.16: X5.17 19.75,25.73 v21.3,24.18
  Bottom 0.16: v21.3,24.18 28.6,16.88 U$40PIN-BACK.P$27
N$35  (via drill 0.3 pad 0.61)
  Top 0.16: X5.16 20.25,26.21 v22.45,24.01
  Bottom 0.16: v22.45,24.01 29,17.46 U$40PIN-BACK.P$26
N$36  (via drill 0.3 pad 0.61)
  Top 0.16: X5.15 20.75,26.64 v23.41,23.98
  Bottom 0.16: v23.41,23.98 29.4,17.99 U$40PIN-BACK.P$25
N$37  (via drill 0.3 pad 0.61)
  Top 0.16: X5.14 21.25,27.05 v23.45,24.85
  Bottom 0.16: v23.45,24.85 29.8,18.5 U$40PIN-BACK.P$24
N$38  (via drill 0.3 pad 0.61)
  Top 0.16: X5.13 21.75,27.48 v24.4,24.83
  Bottom 0.16: v24.4,24.83 30.2,19.03 U$40PIN-BACK.P$23
N$39  (via drill 0.3 pad 0.61)
  Top 0.16: X5.12 22.25,27.85 v24.44,25.71
  Bottom 0.16: v24.44,25.71 30.6,19.55 U$40PIN-BACK.P$22
N$40  (via drill 0.3 pad 0.61)
  Top 0.16: X5.11 22.75,28.23 v25.32,25.66
  Bottom 0.16: v25.32,25.66 31,20.07 U$40PIN-BACK.P$21
N$41  (via drill 0.3 pad 0.71)
  Top 0.16: X1.11 99.07,54.39 v101.42,52.04
  Bottom 0.16: v101.42,52.04 103.37,50.09 103.37,39.17 99.86,35.66 U$2.P$31
N$42  (via drill 0.3 pad 0.71)
  Top 0.16: X1.50 72.79,34.93 v76.61,31.11
  Bottom 0.16: v76.61,31.11 81.22,26.5 99.92,26.5 102.88,29.46 102.88,31.95 99.57,35.26 U$2.P$30
N$43  (via drill 0.3 pad 0.71)
  Top 0.16: X1.49 73.32,35.43 v76.72,32.03
  Bottom 0.16: v76.72,32.03 81.81,26.94 99.72,26.94 102.38,29.6 102.38,31.74 99.26,34.86 U$2.P$29
N$44  (via drill 0.3 pad 0.71)
  Top 0.16: X1.48 73.88,35.93 v76.8,33.01
  Bottom 0.16: v76.8,33.01 82.48,27.33 99.63,27.33 101.93,29.63 101.93,31.73 99.2,34.46 U$2.P$28
N$45  (via drill 0.3 pad 0.71)
  Top 0.16: X1.47 74.43,36.43 v76.86,34
  Bottom 0.16: v76.86,34 83.13,27.73 99.45,27.73 101.44,29.72 101.44,31.71 99.09,34.06 U$2.P$27
N$46  (via drill 0.3 pad 0.71)
  Top 0.16: X1.46 74.99,36.93 v76.93,34.99
  Bottom 0.16: v76.93,34.99 83.8,28.12 99.29,28.12 101.02,29.85 101.02,31.67 99.03,33.66 U$2.P$26
N$47  (via drill 0.3 pad 0.71)
  Top 0.16: X1.45 75.57,37.43 v77.01,35.99
  Bottom 0.16: v77.01,35.99 84.48,28.52 99.16,28.52 100.61,29.97 100.61,31.61 98.96,33.26 U$2.P$25
N$48  (via drill 0.3 pad 0.71)
  Top 0.16: X1.44 75.99,37.93 v76.97,36.95
  Bottom 0.16: v76.97,36.95 85.03,28.89 99.05,28.89 100.23,30.07 100.23,31.44 98.81,32.86 U$2.P$24
N$49  (via drill 0.3 pad 0.71)
  Top 0.16: X1.43 76.83,38.43 v77.74,37.52
  Bottom 0.16: v77.74,37.52 85.96,29.3 98.99,29.3 99.82,30.13 99.82,31.4 98.76,32.46 U$2.P$23
N$50  (via drill 0.3 pad 0.71)
  Top 0.16: X1.41 77.91,39.39 v77.99,39.31
  Bottom 0.16: v77.99,39.31 87.28,30.05 98.54,30.05 98.97,30.48 98.97,31.26 98.57,31.66 U$2.P$21
N$51  (via drill 0.3 pad 0.71)
  Top 0.16: X1.42 77.41,38.93 v77.97,38.37
  Bottom 0.16: U$2.P$22 98.67,32.06 99.41,31.32 99.41,30.3 98.79,29.68 86.66,29.68 v77.97,38.37
N$52  (via drill 0.3 pad 0.71)
  Top 0.16: X1.40 78.61,39.93 v78.76,39.78
  Bottom 0.16: v78.76,39.78 86.88,31.66 U$2.P$20
N$53  (via drill 0.3 pad 0.71)
  Top 0.16: X1.39 79.35,40.39 v79.9,39.84
  Bottom 0.16: U$2.P$19 87.68,32.06 v79.9,39.84
N$54  (via drill 0.3 pad 0.71)
  Top 0.16: X1.38 80.03,40.89 v80.85,40.07
  Bottom 0.16: U$2.P$18 88.46,32.46 v80.85,40.07
N$55  (via drill 0.3 pad 0.71)
  Top 0.16: X1.37 81.05,41.39 v81.52,40.92
  Bottom 0.16: U$2.P$17 89.58,32.86 v81.52,40.92
N$56  (via drill 0.3 pad 0.61)
  Top 0.16: X1.35 82.6,42.43 v83.02,42.01
  Bottom 0.16: v83.02,42.01 91.37,33.66 U$2.P$15
N$57  (via drill 0.3 pad 0.71)
  Top 0.16: X1.36 81.79,41.89 v82.52,41.16
  Bottom 0.16: U$2.P$16 90.42,33.26 v82.52,41.16
N$58  (via drill 0.3 pad 0.71)
  Top 0.16: X1.34 83.45,42.89 v84.2,42.14
  Bottom 0.16: v84.21,42.13 v84.2,42.14 92.28,34.06 U$2.P$14
N$59  (via drill 0.3 pad 0.71)
  Top 0.16: X1.33 84.46,43.39 v84.89,42.96
  Bottom 0.16: U$2.P$13 93.39,34.46 v84.89,42.96
N$60  (via drill 0.3 pad 0.71)
  Top 0.16: X1.32 85.05,43.89 v85.91,43.03
  Bottom 0.16: U$2.P$12 93.54,34.86 85.92,42.48 v85.92,43.02 v85.91,43.03
N$61  (via drill 0.3 pad 0.71)
  Top 0.16: X1.31 86.16,44.39 v86.63,43.92
  Bottom 0.16: U$2.P$11 93.88,35.26 86.63,42.51 v86.63,43.92
N$62  (via drill 0.3 pad 0.71)
  Top 0.16: X1.30 86.72,44.89 v87.63,43.98
  Bottom 0.16: U$2.P$10 94.01,35.66 87.66,42.01 87.66,43.95 v87.63,43.98
N$63  (via drill 0.3 pad 0.71)
  Top 0.16: X1.29 87.78,45.39 v88.39,44.78
  Bottom 0.16: U$2.P$9 94.15,36.06 88.4,41.81 v88.4,44.77 v88.39,44.78
N$64  (via drill 0.3 pad 0.71)
  Top 0.16: X1.28 88.34,45.89 v89.42,44.81
  Bottom 0.16: U$2.P$8 94.34,36.46 89.42,41.38 v89.42,44.81
N$65  (via drill 0.3 pad 0.71)
  Top 0.16: X1.27 89.26,46.39 v90.14,45.51
  Bottom 0.16: U$2.P$7 94.51,36.86 90.13,41.24 v90.13,45.5 v90.14,45.51
N$66  (via drill 0.3 pad 0.71)
  Top 0.16: X1.26 89.88,46.89 v91.26,45.51
  Bottom 0.16: U$2.P$6 94.71,37.26 91.24,40.73 91.24,45.49 v91.26,45.51
N$67  (via drill 0.3 pad 0.71)
  Top 0.16: X1.25 90.84,47.39 v92.01,46.22
  Bottom 0.16: U$2.P$5 94.9,37.66 92.02,40.54 v92.02,46.21 v92.01,46.22
N$68  (via drill 0.3 pad 0.71)
  Top 0.16: X1.24 91.32,47.89 v93.01,46.2
  Bottom 0.16: U$2.P$4 95.12,38.06 93.02,40.16 v93.02,46.19 v93.01,46.2
N$69  (via drill 0.3 pad 0.71)
  Top 0.16: X1.23 92.24,48.39 v93.63,47
  Bottom 0.16: U$2.P$3 95.38,38.46 93.65,40.19 93.65,46.98 v93.63,47
N$70  (via drill 0.3 pad 0.71)
  Top 0.16: X1.22 92.79,48.89 v94.66,46.99
  Bottom 0.16: U$2.P$2 95.57,38.86 94.68,39.75 94.68,46.97 v94.66,46.99
N$71  (via drill 0.3 pad 0.71)
  Top 0.16: X1.21 93.24,49.39 v95.74,46.89
  Bottom 0.16: v95.75,46.88 v95.74,46.89 95.74,39.62 96.1,39.26 U$2.P$1
N$72  (via drill 0.3 pad 0.71)
  Top 0.16: X1.12 98.55,53.89 v100.38,52.06
  Bottom 0.16: v100.38,52.06 102.79,49.65 102.79,39.21 99.64,36.06 U$2.P$32
N$73  (via drill 0.3 pad 0.71)
  Top 0.16: X1.13 97.98,53.39 v100.38,50.99
  Bottom 0.16: v100.38,50.99 102.26,49.11 102.26,39.25 99.47,36.46 U$2.P$33
N$74  (via drill 0.3 pad 0.71)
  Top 0.16: X1.14 97.44,52.89 v99.23,51.1
  Bottom 0.16: v99.23,51.1 101.77,48.56 101.77,39.29 99.34,36.86 U$2.P$34
N$75  (via drill 0.3 pad 0.71)
  Top 0.16: X1.15 96.9,52.39 v99.28,50.01
  Bottom 0.16: v99.28,50.01 101.26,48.03 101.26,39.3 99.22,37.26 U$2.P$35
N$76  (via drill 0.3 pad 0.71)
  Top 0.16: X1.16 96.35,51.89 v98.23,50.01
  Bottom 0.16: v98.23,50.01 100.73,47.51 100.73,39.3 99.09,37.66 U$2.P$36
N$77  (via drill 0.3 pad 0.71)
  Top 0.16: X1.17 95.68,51.39 v98.13,48.94
  Bottom 0.16: v98.13,48.94 100.21,46.86 100.21,39.31 98.96,38.06 U$2.P$37
N$78  (via drill 0.3 pad 0.71)
  Top 0.16: X1.18 95.11,50.89 v97.01,48.99
  Bottom 0.16: v97.01,48.99 99.75,46.25 99.75,39.33 98.88,38.46 U$2.P$38
N$79  (via drill 0.3 pad 0.71)
  Top 0.16: X1.19 94.46,50.39 v96.95,47.9
  Bottom 0.16: U$2.P$39 98.83,38.86 99.33,39.36 99.33,45.52 v96.95,47.9
N$80  (via drill 0.3 pad 0.71)
  Top 0.16: X1.20 93.87,49.89 v95.85,47.91
  Bottom 0.16: 98.22,39.21 U$2.P$40 98.77,39.26 98.92,39.41 98.92,44.84 v95.85,47.91
N$81
  Top 0.16: U$3.P$20 31.01,11.36 30.52,10.87 29.66,10.87 29.23,11.3 29.23,16.71 38.75,26.23 X3.41 38.78,32.87
N$82
  Top 0.16: U$3.P$11 34.6,8.38 33.44,7.22 27.54,7.22 25.45,9.31 25.45,18.49 34.28,27.32 34.28,32.87 X3.50
N$83
  Top 0.16: U$3.P$21 31,17.95 39.25,26.2 X3.40 39.28,32.87
N$84
  Top 0.16: U$3.P$22 31.41,17.75 39.78,26.12 39.78,32.87 X3.39
N$85
  Top 0.16: U$3.P$23 31.78,14.58 31.78,17.53 40.25,26 X3.38 40.28,32.87
N$86
  Top 0.16: U$3.P$24 32.19,17.41 40.78,26 40.78,32.87 X3.37
N$87
  Top 0.16: U$3.P$25 32.58,14.58 32.58,17.33 41.25,26 X3.36 41.28,32.87
N$88
  Top 0.16: U$3.P$26 33.01,17.31 41.75,26.05 X3.35 41.78,32.87
N$89
  Top 0.16: U$3.P$27 33.4,17.21 42.25,26.06 X3.34 42.28,32.87
N$90
  Top 0.16: U$3.P$28 33.8,17.1 42.75,26.05 X3.33 42.78,32.87
N$91
  Top 0.16: U$3.P$29 34.2,16.97 43.25,26.02 X3.32 43.28,32.87
N$92
  Top 0.16: U$3.P$30 34.6,16.85 43.75,26 X3.31 43.78,32.87
N$93
  Top 0.16: U$3.P$31 35.01,16.77 44.25,26.01 X3.30 44.28,32.87
N$94
  Top 0.16: U$3.P$32 35.41,16.66 44.75,26 X3.29 44.78,32.87
N$95
  Top 0.16: U$3.P$33 35.81,16.56 45.25,26 X3.28 45.28,32.87
N$96
  Top 0.16: 45.71,32.86 X3.27 | U$3.P$34 36.21,16.42 45.75,25.96 X3.27 | X3.27 45.78,32.87
N$97
  Top 0.16: U$3.P$35 36.61,16.28 46.28,25.95 46.28,32.87 X3.26
N$98
  Top 0.16: U$3.P$36 36.99,16.11 46.78,25.9 46.78,32.87 X3.25
N$99
  Top 0.16: U$3.P$37 37.39,15.98 47.25,25.84 X3.24 47.28,32.87
N$100
  Top 0.16: U$3.P$38 37.8,15.86 47.78,25.84 47.78,32.87 X3.23
N$101
  Top 0.16: U$3.P$39 38.19,15.65 48.28,25.74 48.28,32.87 X3.22
N$102
  Top 0.16: U$3.P$40 38.6,15.39 48.75,25.54 X3.21 48.78,32.87
N$103
  Top 0.16: U$3.P$19 31.42,12.14 31.42,10.94 30.89,10.41 29.39,10.41 28.83,10.97 28.83,16.81 38.25,26.23 X3.42 38.28,32.87
N$104
  Top 0.16: U$3.P$18 31.81,10.66 31.21,10.06 29.18,10.06 28.44,10.8 28.44,16.94 37.75,26.25 X3.43 37.78,32.87
N$105
  Top 0.16: U$3.P$17 32.22,12.14 32.22,10.4 31.45,9.63 29.06,9.63 28.08,10.61 28.08,17.11 37.25,26.28 X3.44 37.28,32.87
N$106
  Top 0.16: U$3.P$16 32.6,10.23 31.66,9.29 28.71,9.29 27.67,10.33 27.67,17.35 36.75,26.43 X3.45
N$107
  Top 0.16: U$3.P$15 33.02,12.14 33.02,9.84 32.08,8.9 28.47,8.9 27.22,10.15 27.22,17.56 36.25,26.59 X3.46 36.28,32.87
N$108
  Top 0.16: U$3.P$14 33.44,12.12 33.44,9.56 32.37,8.49 28.22,8.49 26.83,9.88 26.83,17.87 35.75,26.79 X3.47 35.78,32.87
N$109
  Top 0.16: U$3.P$13 33.81,9.18 32.72,8.09 28.03,8.09 26.38,9.74 26.38,18.11 35.25,26.98 X3.48 35.28,32.87
N$110
  Top 0.16: U$3.P$12 34.2,8.73 33.16,7.69 27.8,7.69 25.91,9.58 25.91,18.29 34.75,27.13 X3.49 34.78,32.87
N$111
  Top 0.16: U$3.P$1 38.61,11.59 38.97,11.23 40.28,11.23 40.7,11.65 40.7,14.57 49.25,23.12 X3.20
N$112
  Top 0.16: U$3.P$2 38.21,11.27 38.59,10.89 40.59,10.89 41.26,11.56 41.26,14.4 49.75,22.89 X3.19
N$113
  Top 0.16: U$3.P$3 37.81,11.08 38.43,10.46 40.87,10.46 41.71,11.3 41.71,14.19 50.25,22.73 X3.18
N$114
  Top 0.16: U$3.P$4 37.42,12.14 37.42,10.79 38.12,10.09 41.23,10.09 42.21,11.07 42.21,14.11 50.75,22.65 X3.17
N$115
  Top 0.16: U$3.P$5 37.01,10.5 37.79,9.72 41.54,9.72 42.74,10.92 42.74,14.01 51.25,22.52 X3.16
N$116
  Top 0.16: U$3.P$6 36.59,10.09 37.31,9.37 41.9,9.37 43.25,10.72 43.25,13.93 51.75,22.43 X3.15
N$117
  Top 0.16: U$3.P$7 36.21,9.77 37.01,8.97 42.18,8.97 43.73,10.52 43.73,13.77 52.25,22.29 X3.14
N$118
  Top 0.16: U$3.P$8 35.77,12.13 35.77,9.64 36.93,8.48 42.45,8.48 44.28,10.31 44.28,13.67 52.75,22.14 X3.13
N$119
  Top 0.16: U$3.P$9 35.43,12.13 35.43,9.33 36.61,8.15 42.74,8.15 44.72,10.13 44.72,13.55 53.25,22.08 X3.12
N$120
  Top 0.16: U$3.P$10 34.99,8.89 36.19,7.69 42.96,7.69 45.2,9.93 45.2,13.48 53.75,22.03 X3.11
N$121
  Top 0.16: X2.40 85.57,8.95 95.37,18.81 99.51,18.81 102.42,21.72 102.42,25.83 100.6,27.65 U$1.P$31
N$122
  Top 0.16: X2.39 85.45,9.39 95.18,19.21 99.35,19.21 102.01,21.87 102.01,25.7 100.46,27.25 U$1.P$32
N$123
  Top 0.16: X2.38 85.32,9.89 94.99,19.64 99.28,19.64 101.65,22.01 101.65,25.47 100.26,26.86 U$1.P$33 | U$1.P$33 | U$1.P$33
N$124
  Top 0.16: X2.37 85.22,10.39 94.87,20.09 99.26,20.09 101.28,22.11 101.28,25.38 100.2,26.46 U$1.P$34
N$125
  Top 0.16: X2.36 85.17,10.89 94.78,20.5 99.11,20.5 100.87,22.26 100.87,25.27 100.08,26.06 U$1.P$35
N$126
  Top 0.16: X2.35 85.09,11.39 94.6,20.9 99,20.9 100.52,22.42 100.52,25.05 99.89,25.68 98.19,25.68 U$1.P$36
N$127
  Top 0.16: X2.34 85.02,11.89 94.45,21.32 98.92,21.32 100.13,22.53 100.13,24.88 99.74,25.27 U$1.P$37
N$128
  Top 0.16: X2.33 84.92,12.39 94.31,21.78 98.86,21.78 99.81,22.73 99.81,24.54 99.49,24.86 U$1.P$38
N$129
  Top 0.16: X2.32 84.79,12.89 94.12,22.22 98.8,22.22 99.48,22.94 99.48,24.11 99.14,24.45 U$1.P$39
N$130
  Top 0.16: X2.31 84.71,13.39 93.92,22.6 98.55,22.61 99.12,23.19 99.12,23.77 98.87,24.06 U$1.P$40
N$131
  Top 0.16: X2.1 80.93,28.43 89.98,37.48 99.83,37.48 102.71,34.6 102.71,30.46 100.29,28.04 98.19,28.04 U$1.P$30
N$132
  Top 0.16: X2.2 80.99,27.93 90.06,37 99.72,37 102.31,34.41 102.31,30.55 100.22,28.46 U$1.P$29
N$133
  Top 0.16: X2.3 80.99,27.43 90.14,36.58 99.59,36.58 101.95,34.22 101.95,30.69 100.12,28.86 U$1.P$28
N$134
  Top 0.16: X2.4 81.05,26.93 90.25,36.13 99.48,36.13 101.61,34 101.61,30.86 99.99,29.24 98.19,29.24 U$1.P$27
N$135
  Top 0.16: X2.5 81.04,26.43 90.36,35.75 99.32,35.75 101.25,33.76 101.25,31.04 99.91,29.66 U$1.P$26
N$136
  Top 0.16: X2.6 81.1,25.93 90.54,35.37 99.15,35.37 100.9,33.62 100.9,31.14 99.82,30.06 U$1.P$25
N$137
  Top 0.16: X2.7 81.11,25.43 90.55,34.87 99.05,34.87 100.49,33.43 100.49,31.32 99.63,30.46 U$1.P$24
N$138
  Top 0.16: X2.8 81.2,24.93 90.63,34.36 98.9,34.36 100.01,33.25 100.01,31.53 99.34,30.86 U$1.P$23
N$139
  Top 0.16: X2.9 81.27,24.43 90.73,33.89 98.78,33.89 99.58,33.09 99.58,31.76 99.07,31.25 U$1.P$22
N$140
  Top 0.16: X2.10 81.28,23.93 90.64,33.29 98.71,33.29 99.11,32.89 99.11,31.97 98.77,31.63 98.2,31.63 U$1.P$21
N$141
  Top 0.16: X2.11 81.34,23.39 89.61,31.66 U$1.P$20
N$142
  Top 0.16: X2.12 81.44,22.89 89.82,31.27 U$1.P$19
N$143
  Top 0.16: X2.13 81.68,22.39 90.14,30.85 U$1.P$18
N$144
  Top 0.16: X2.14 81.82,21.89 90.41,30.48 96.4,30.48 U$1.P$17
N$145
  Top 0.16: X2.15 81.99,21.39 90.67,30.07 U$1.P$16
N$146
  Top 0.16: X2.16 82.14,20.89 90.91,29.66 U$1.P$15
N$147
  Top 0.16: X2.17 82.27,20.39 91.16,29.28 96.4,29.28 U$1.P$14
N$148
  Top 0.16: X2.18 82.4,19.89 91.39,28.88 96.4,28.88 U$1.P$13
N$149
  Top 0.16: X2.19 82.56,19.39 91.64,28.47 U$1.P$12
N$150
  Top 0.16: X2.20 82.76,18.89 91.92,28.05 U$1.P$11
N$151
  Top 0.16: X2.21 82.93,18.39 92.19,27.65 U$1.P$10
N$152
  Top 0.16: X2.22 83.12,17.89 92.48,27.25 U$1.P$9
N$153
  Top 0.16: X2.23 83.29,17.39 92.75,26.85 U$1.P$8
N$154
  Top 0.16: X2.24 83.48,16.89 93.05,26.46 U$1.P$7
N$155
  Top 0.16: X2.25 83.68,16.39 93.34,26.05 U$1.P$6
N$156
  Top 0.16: X2.26 83.79,15.89 93.55,25.65 U$1.P$5
N$157
  Top 0.16: X2.27 83.93,15.39 93.8,25.26 U$1.P$4
N$158
  Top 0.16: X2.28 84.01,14.89 94,24.88 96.4,24.88 U$1.P$3
N$159
  Top 0.16: X2.29 84.15,14.39 94.23,24.47 U$1.P$2
N$160
  Top 0.16: X2.30 84.27,13.89 94.42,24.04 96.4,24.04 U$1.P$1
N$165
  Bottom 0.16: IC1.19 44.06,74.24 54.28,64.02 U$15.P$1
N$166
  Bottom 0.16: IC1.18 44.42,74.64 47.71,71.35 U$14.P$1
N$167
  Bottom 0.16: IC1.17 54.49,75.04 58.1,78.65 59.97,78.65 U$13.P$1
N$168
  Bottom 0.16: IC1.16 47.25,75.44 57.81,86 U$12.P$1
N$169
  Bottom 0.16: IC1.15 30.2,76.76 31.3,77.86 47.9,77.86 56.78,86.74 56.78,90.12 U$11.P$1
N$170
  Bottom 0.16: IC1.14 29.8,76.95 31.24,78.39 47.52,78.39 56.16,87.03 56.16,96.83 U$10.P$1
N$171
  Bottom 0.16: IC1.13 29.4,77.45 31.02,79.07 47.1,79.07 55.39,87.36 55.39,103.39 U$9.P$1
N$172
  Bottom 0.16: IC1.12 29,78.91 28.03,79.88 11.17,79.88 5.45,85.6 5.45,97.55 U$8.P$1
N$173
  Bottom 0.16: IC1.11 28.6,78.5 27.79,79.31 10.69,79.31 4.56,85.44 4.56,91.11 U$7.P$1
N$174
  Bottom 0.16: U$6.P$1 11.2,76.81 25.18,76.81 26.55,75.44 IC1.10
N$175
  Bottom 0.16: IC1.9 26.38,75.03 25.2,76.21 4.47,76.21 U$5.P$1 1.98,78.99
N$176
  Bottom 0.16: IC1.8 26.16,74.64 25.09,75.7 6.35,75.7 U$4.P$1 2.02,71.66
N$177
  Bottom 0.16: 2.03,64.32 U$40.P$1 9.52,64.03 10.95,62.6 IC3.19
N$178
  Bottom 0.16: IC3.18 10.55,62.25 9.78,63.02 4.87,63.02 2,60.15 U$41.P$1 2.02,57.04
N$179
  Bottom 0.16: IC3.17 10.16,60.8 10.16,61.81 9.44,62.53 5.28,62.53 3.78,61.03 3.78,51.14 U$42.P$1
N$180
  Bottom 0.16: IC3.16 9.75,61.58 9.37,61.96 | 9.37,61.96 9.35,61.98 | 9.37,61.96 5.43,61.96 4.43,60.96 4.43,43.51 3,42.08 U$43.P$1
N$181
  Bottom 0.16: IC3.15 5.94,60.22 4.93,59.21 4.93,32.93 U$44.P$1
N$182
  Bottom 0.16: IC3.14 6.26,59.82 5.46,59.02 5.46,30.94 U$45.P$1
N$183
  Bottom 0.16: 9.18,59.43 IC3.13 6.58,59.42 5.93,58.77 5.93,23.96 U$46.P$1
N$184
  Bottom 0.16: IC3.12 7.08,59.02 6.45,58.39 6.45,17.16 U$47.P$1
N$185
  Bottom 0.16: IC3.10 9.76,57.53 7.61,55.39 7.61,7.61 U$49.P$1
N$186
  Bottom 0.16: IC3.11 7.7,58.62 7.08,58 7.08,10.46 U$48.P$1
N$187
  Bottom 0.16: IC3.9 10.15,57.2 8.14,55.19 8.14,4.32 U$50.P$1
N$188
  Bottom 0.16: IC3.8 10.55,56.94 8.59,54.97 8.59,9.57 U$51.P$1
N$189
  Top 0.254: JP4.1 JP2.1
N$190
  Top 0.254: JP4.2 JP2.2
N$192
  Bottom 0.16: IC1.5 28.6,71.6 26.25,69.25 C6.1
N$193
  Bottom 0.16: C2.1 50.71,58.27 IC2.5
N$194
  Bottom 0.16: IC1.7 R1.2
N$195
  Bottom 0.16: U$36.P$1 58.84,56.69 57.26,58.27 54.4,58.27 53.83,57.7 IC2.8
N$196
  Bottom 0.16: U$35.P$1 60,54.7 56.87,57.83 54.41,57.83 54.22,57.64 IC2.9
N$197
  Bottom 0.16: IC3.5 12.87,58.62 13.41,58.08 C4.1
N$198
  Bottom 0.16: IC2.10 57.09,57.1 58.54,55.65 58.54,43.49 U$34.P$1
N$199
  Bottom 0.16: IC2.11 57.12,56.52 58.22,55.34 58.18,41.68 60.02,39.84 U$33.P$1
N$200
  Bottom 0.16: IC2.12 56.97,56.15 57.83,55.19 57.86,41.24 58.69,40.41 58.69,28.68 U$32.P$1
N$201
  Bottom 0.16: IC2.13 56.79,55.7 57.46,55.01 57.47,40.77 58.21,40.03 58.21,21.83 U$31.P$1
N$202
  Bottom 0.16: IC2.14 56.6,55.33 57.1,54.83 57.11,40.34 57.86,39.59 57.86,14.87 59.96,12.77 U$30.P$1
N$203
  Bottom 0.16: IC2.15 56.52,54.93 56.77,54.68 | 56.77,54.68 56.75,54.66 | 56.77,54.68 56.77,40.05 57.53,39.29 57.53,11.83 57.53,11.67 57.53,7.85 U$29.P$1
N$204
  Bottom 0.16: IC2.16 54.63,54.05 56.42,52.27 | 56.42,52.27 56.43,52.25 | 56.42,52.27 56.42,39.91 57.2,39.11 57.2,4.8 U$28.P$1
N$205
  Bottom 0.16: IC2.17 54.23,53.97 56.08,52.12 56.08,39.76 56.88,38.96 56.88,2.7 U$27.P$1
N$206
  Bottom 0.16: IC2.18 53.83,53.9 55.76,51.89 55.75,39.63 56.56,38.82 56.56,4.97 53.54,1.95 42.89,1.95 U$26.P$1
N$207
  Bottom 0.16: 53.43,54.28 IC2.19 53.43,53.84 55.44,51.67 55.4,39.62 55.41,39.44 56.21,38.64 56.21,8.77 51.05,3.61 31.11,3.61 U$25.P$1
N$228
  Bottom 0.16: IC1.4 29,68.64 SJ1.1 27.81,64.18 U$37.P$1
N$230
  Bottom 0.16: R9.2 IC2.7
N$231
  Bottom 0.16: IC3.7 R12.2
N$243
  Bottom 0.16: U$38.P$1 arc90 48.72,65.42 SJ2.1 arc90 SJ2.1 48.73,59.11 51.72,56.12 IC2.4
N$244
  Bottom 0.16: IC3.4 13.1,59.02 16.41,55.71 17.33,55.71 | 17.33,55.71 SJ3.1 | U$39.P$1 17.33,54.19 17.33,55.71
N$245
  Top 0.254: JP4.3 JP2.3
N$246
  Top 0.254: JP4.4 JP2.4
N$247
  Top 0.254: JP4.5 JP2.5
N$248
  Top 0.254: JP4.6 JP2.6
N$249
  Top 0.254: JP4.7 JP2.7
N$250
  Top 0.254: JP4.8 JP2.8
N$251
  Top 0.254: JP4.9 JP2.9
N$252
  Top 0.254: JP4.10 JP2.10
N$253
  Top 0.254: JP4.11 JP2.11
N$254
  Top 0.254: JP4.12 JP2.12
N$255
  Top 0.254: JP2.13 JP4.13
N$256
  Top 0.254: JP4.14 JP2.14
N$257
  Top 0.254: JP1.1 JP5.14
N$258
  Top 0.254: JP1.2 JP5.13
N$259
  Top 0.254: JP1.3 JP5.12
N$260
  Top 0.254: JP1.4 JP5.11
N$261
  Top 0.254: JP1.5 JP5.10
N$262
  Top 0.254: JP1.8 JP5.7
N$263
  Top 0.254: JP1.9 JP5.6
N$264
  Top 0.254: JP1.10 JP5.5
N$265
  Top 0.254: JP1.13 JP5.2
N$266
  Top 0.254: JP1.14 JP5.1
N$IRQ1
  Bottom 0.16: IC1.1 30.2,72.27 30.64,71.83 R2.1
N$IRQ2
  Bottom 0.16: 52.43,54.95 IC2.1 51.3,54.93 R5.1
N$IRQ3
  Bottom 0.16: IC3.1 14.53,60.22 15.12,60.81 R8.1
N$SCL  (via drill 0.3, 0.3 pad 0.61)
  Top 0.16: v19.55,61.5 28.51,61.5 | 28.51,61.5 33.5,56.51 v43.68,56.51 | 28.51,61.5 31.07,64.06 v31.07,70.62 | v10.82,59.88 10.82,46.23 4.78,40.19 4.78,32.93 X5.47
  Bottom 0.16: v10.82,59.88 IC3.2 15.78,59.82 R10.1 19.53,61.52 v19.55,61.5 | IC1.2 29.8,71.89 v31.07,70.62 R3.1 | 52.43,55.35 IC2.2 46.71,55.33 R6.1 v43.68,56.51
N$SCL2
  Top 0.16: X1.4 83.31,57.93 84.66,59.28 84.66,70.01 JP5.8
  Top 0.254: JP5.8 JP1.7
N$SDA  (via drill 0.3 pad 0.61)  (1 unrouted)
  Top 0.16: X5.50 3.25,52.1 v10.1,58.95
  Bottom 0.16: 29.44,73.22 29.44,65.91 30.02,65.21 R4.1 32.45,64.12 33.91,61.44 | 33.91,61.44 R7.1 45.7,61.42 51.38,55.74 IC2.3 | R11.1 29.11,58.1 33.91,61.44 | IC3.3 11.92,59.43 | IC3.3 14.84,59.42 16.18,58.08 20.1,58.08 R11.1 | R11.1 20.12,55.73 SJ3.2 | v10.1,58.95 10.8,58.95 11.27,59.42 IC3.3
N$SDA2
  Top 0.16: X1.1 80.9,59.43 82.14,60.67 JP5.9
  Top 0.254: JP5.9 JP1.6

### Text on the board
Top: interactionlab.io | version: 0.2 | interactionlab.io | version: 0.2